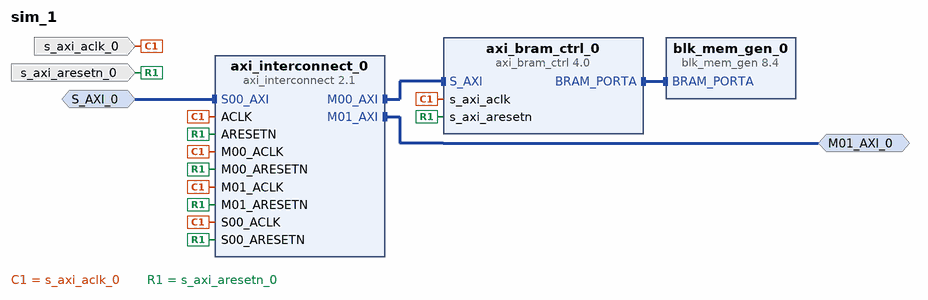
[diagram p0: block diagram of the top level]
# Vivado block design sim_1, xc7z045ffg900-2, Vivado 2017.4
create_bd_design sim_1

create_bd_intf_port -mode Slave -vlnv xilinx.com:interface:aximm_rtl:1.0 S_AXI_0
set_property -dict [list \
  CONFIG.DATA_WIDTH 64 \
  CONFIG.PROTOCOL AXI4 \
  CONFIG.ID_WIDTH 6 \
  CONFIG.ADDR_WIDTH 32 \
  CONFIG.AWUSER_WIDTH 0 \
  CONFIG.ARUSER_WIDTH 0 \
  CONFIG.WUSER_WIDTH 0 \
  CONFIG.RUSER_WIDTH 0 \
  CONFIG.BUSER_WIDTH 0 \
  CONFIG.READ_WRITE_MODE READ_WRITE \
  CONFIG.HAS_BURST 1 \
  CONFIG.HAS_LOCK 0 \
  CONFIG.HAS_PROT 0 \
  CONFIG.HAS_CACHE 0 \
  CONFIG.HAS_QOS 0 \
  CONFIG.HAS_REGION 0 \
  CONFIG.HAS_WSTRB 0 \
  CONFIG.HAS_BRESP 0 \
  CONFIG.HAS_RRESP 0 \
  CONFIG.SUPPORTS_NARROW_BURST 0 \
  CONFIG.NUM_READ_OUTSTANDING 2 \
  CONFIG.NUM_WRITE_OUTSTANDING 2 \
  CONFIG.MAX_BURST_LENGTH 256 \
  CONFIG.NUM_READ_THREADS 2 \
  CONFIG.NUM_WRITE_THREADS 2 \
  CONFIG.RUSER_BITS_PER_BYTE 0 \
  CONFIG.WUSER_BITS_PER_BYTE 0 \
] [get_bd_intf_ports S_AXI_0]
create_bd_intf_port -mode Master -vlnv xilinx.com:interface:aximm_rtl:1.0 M01_AXI_0
set_property -dict [list \
  CONFIG.DATA_WIDTH 64 \
  CONFIG.PROTOCOL AXI4 \
  CONFIG.ADDR_WIDTH 32 \
  CONFIG.NUM_READ_OUTSTANDING 2 \
  CONFIG.NUM_WRITE_OUTSTANDING 2 \
] [get_bd_intf_ports M01_AXI_0]
create_bd_port -dir I -type clk s_axi_aclk_0
create_bd_port -dir I -type rst s_axi_aresetn_0

create_bd_cell -type ip -vlnv xilinx.com:ip:axi_bram_ctrl:4.0 axi_bram_ctrl_0
set_property -dict {CONFIG.DATA_WIDTH 64 CONFIG.SUPPORTS_NARROW_BURST 0 CONFIG.SINGLE_PORT_BRAM 1} [get_bd_cells axi_bram_ctrl_0]
create_bd_cell -type ip -vlnv xilinx.com:ip:blk_mem_gen:8.4 blk_mem_gen_0
set_property -dict [list \
  CONFIG.Memory_Type Single_Port_RAM \
  CONFIG.Enable_32bit_Address true \
  CONFIG.Write_Width_A 64 \
  CONFIG.Read_Width_A 64 \
  CONFIG.Register_PortA_Output_of_Memory_Primitives false \
  CONFIG.Use_RSTA_Pin true \
  CONFIG.Port_A_Write_Rate 50 \
  CONFIG.use_bram_block BRAM_Controller \
  CONFIG.EN_SAFETY_CKT true \
] [get_bd_cells blk_mem_gen_0]
create_bd_cell -type ip -vlnv xilinx.com:ip:axi_interconnect:2.1 axi_interconnect_0
set_property -dict [list \
  CONFIG.STRATEGY 2 \
  CONFIG.ENABLE_ADVANCED_OPTIONS 1 \
  CONFIG.XBAR_DATA_WIDTH 64 \
  CONFIG.SYNCHRONIZATION_STAGES 3 \
  CONFIG.S00_HAS_DATA_FIFO 2 \
] [get_bd_cells axi_interconnect_0]

# ---- connections ----

connect_bd_intf_net [get_bd_intf_pins blk_mem_gen_0/BRAM_PORTA] [get_bd_intf_pins axi_bram_ctrl_0/BRAM_PORTA]
connect_bd_intf_net [get_bd_intf_pins axi_bram_ctrl_0/S_AXI] [get_bd_intf_pins axi_interconnect_0/M00_AXI]
connect_bd_intf_net -intf_net S_AXI_0_1 [get_bd_intf_ports S_AXI_0] [get_bd_intf_pins axi_interconnect_0/S00_AXI]
connect_bd_intf_net [get_bd_intf_ports M01_AXI_0] [get_bd_intf_pins axi_interconnect_0/M01_AXI]
connect_bd_net -net s_axi_aclk_0_1 [get_bd_ports s_axi_aclk_0] \
  [get_bd_pins axi_bram_ctrl_0/s_axi_aclk] [get_bd_pins axi_interconnect_0/ACLK] [get_bd_pins axi_interconnect_0/S00_ACLK] \
  [get_bd_pins axi_interconnect_0/M00_ACLK] [get_bd_pins axi_interconnect_0/M01_ACLK]
connect_bd_net -net s_axi_aresetn_0_1 [get_bd_ports s_axi_aresetn_0] \
  [get_bd_pins axi_bram_ctrl_0/s_axi_aresetn] [get_bd_pins axi_interconnect_0/ARESETN] \
  [get_bd_pins axi_interconnect_0/S00_ARESETN] [get_bd_pins axi_interconnect_0/M00_ARESETN] \
  [get_bd_pins axi_interconnect_0/M01_ARESETN]

# ---- address map ----
assign_bd_address -offset 0x00000000 -range 1M -target_address_space [get_bd_addr_spaces S_AXI_0] [get_bd_addr_segs axi_bram_ctrl_0/S_AXI/Mem0]
assign_bd_address -offset 0x00100000 -range 1M -target_address_space [get_bd_addr_spaces S_AXI_0] [get_bd_addr_segs M01_AXI_0/Reg]

validate_bd_design
save_bd_design
